# EAGLE schematic dual-power (EAGLE 9.6.1)
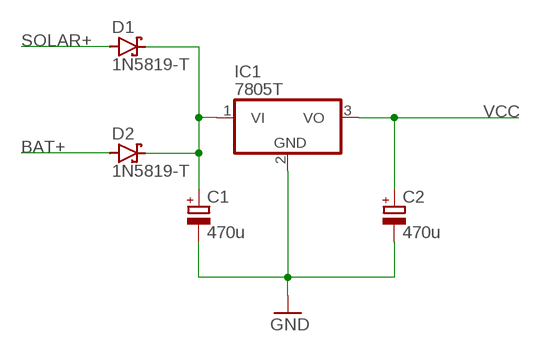
[diagram p0: schematic, sheet 1]

## Parts
C1  470u  CPOL-EUE7.5-18  [E7,5-18]
C2  470u  CPOL-EUE7.5-18  [E7,5-18]
D1  1N5819-T  [DO41-7.6]
D2  1N5819-T  [DO41-7.6]
IC1  7805T  [TO220H]

## Nets
BAT+: D2.A
GND: C1.- C2.- IC1.2(GND)
N$1: C1.+ D1.C D2.C IC1.1(VI)
SOLAR+: D1.A
VCC: C2.+ IC1.3(VO)

## Library data of the parts
C1 C2 = rcl:CPOL-EU: POLARIZED CAPACITOR, European symbol; SPICEPREFIX: C
D1 D2 = diode:1N581*: 1.0A SCHOTTKY BARRIER RECTIFIER Source: http://www.diodes.com/datasheets/ds23001.pdf
IC1 = linear:78*: Positive VOLTAGE REGULATOR Source: http://cache.national.com/ds/LM/LM78L05.pdf http://www.fairchildsemi.com/ds/LM/LM7805.pdf